# EAGLE design v1 (EAGLE 9.6.2)
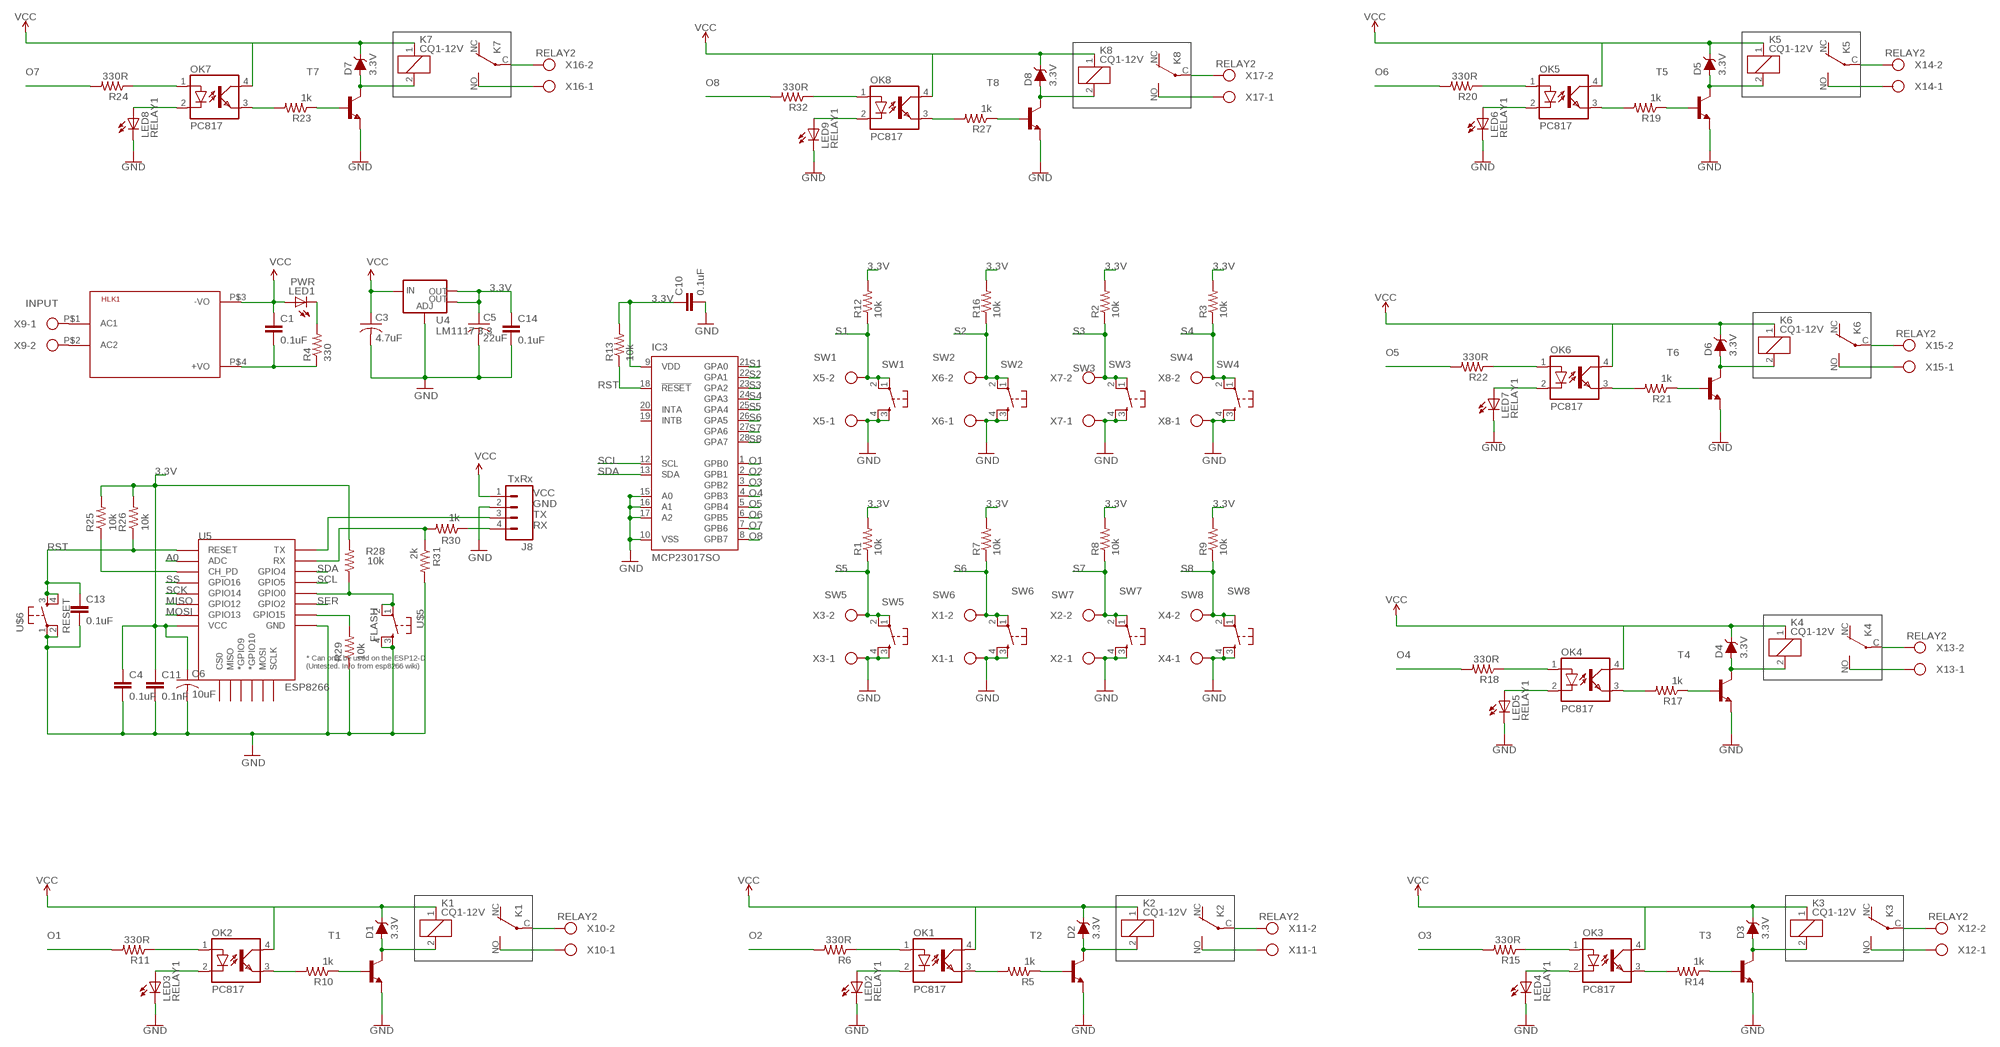
[diagram p0: schematic, sheet 1]

## Parts
C1  0.1uF  CAP0805  [0805]
C3  4.7uF  C-USC1206  [C1206]
C4  0.1uF  CAP0805  [0805]
C5  22uF  C-USC1206  [C1206]
C6  10uF  C-USC1206  [C1206]
C10  0.1uF  CAP0805  [0805]
C11  0.1nF  CAP0805  [0805]
C13  0.1uF  CAP0805  [0805]
C14  0.1uF  CAP0805  [0805]
D1  3.3V  DIODE-ZENER-MM3Z3V3T1G  [SOD-323]
D2  3.3V  DIODE-ZENER-MM3Z3V3T1G  [SOD-323]
D3  3.3V  DIODE-ZENER-MM3Z3V3T1G  [SOD-323]
D4  3.3V  DIODE-ZENER-MM3Z3V3T1G  [SOD-323]
D5  3.3V  DIODE-ZENER-MM3Z3V3T1G  [SOD-323]
D6  3.3V  DIODE-ZENER-MM3Z3V3T1G  [SOD-323]
D7  3.3V  DIODE-ZENER-MM3Z3V3T1G  [SOD-323]
D8  3.3V  DIODE-ZENER-MM3Z3V3T1G  [SOD-323]
HLK1  HLK-PM013W  [HLK-PM01]
IC3  MCP23017SO  [SO28W]
J8  TxRx  M04POLAR  [MOLEX-1X4]
K1  CQ1-12V  [CQ1]
K2  CQ1-12V  [CQ1]
K3  CQ1-12V  [CQ1]
K4  CQ1-12V  [CQ1]
K5  CQ1-12V  [CQ1]
K6  CQ1-12V  [CQ1]
K7  CQ1-12V  [CQ1]
K8  CQ1-12V  [CQ1]
LED1  PWR  LEDCHIP-LED0805  [CHIP-LED0805]
LED2  RELAY1  LEDCHIP-LED0805  [CHIP-LED0805]
LED3  RELAY1  LEDCHIP-LED0805  [CHIP-LED0805]
LED4  RELAY1  LEDCHIP-LED0805  [CHIP-LED0805]
LED5  RELAY1  LEDCHIP-LED0805  [CHIP-LED0805]
LED6  RELAY1  LEDCHIP-LED0805  [CHIP-LED0805]
LED7  RELAY1  LEDCHIP-LED0805  [CHIP-LED0805]
LED8  RELAY1  LEDCHIP-LED0805  [CHIP-LED0805]
LED9  RELAY1  LEDCHIP-LED0805  [CHIP-LED0805]
OK1  PC817  [DIL04]
OK2  PC817  [DIL04]
OK3  PC817  [DIL04]
OK4  PC817  [DIL04]
OK5  PC817  [DIL04]
OK6  PC817  [DIL04]
OK7  PC817  [DIL04]
OK8  PC817  [DIL04]
R1  10k  RESISTOR0805-RES  [0805]
R2  10k  RESISTOR0805-RES  [0805]
R3  10k  RESISTOR0805-RES  [0805]
R4  330  RESISTOR0805-RES  [0805]
R5  1k  RESISTOR0805-RES  [0805]
R6  330R  RESISTOR0805-RES  [0805]
R7  10k  RESISTOR0805-RES  [0805]
R8  10k  RESISTOR0805-RES  [0805]
R9  10k  RESISTOR0805-RES  [0805]
R10  1k  RESISTOR0805-RES  [0805]
R11  330R  RESISTOR0805-RES  [0805]
R12  10k  RESISTOR0805-RES  [0805]
R13  10k  RESISTOR0805-RES  [0805]
R14  1k  RESISTOR0805-RES  [0805]
R15  330R  RESISTOR0805-RES  [0805]
R16  10k  RESISTOR0805-RES  [0805]
R17  1k  RESISTOR0805-RES  [0805]
R18  330R  RESISTOR0805-RES  [0805]
R19  1k  RESISTOR0805-RES  [0805]
R20  330R  RESISTOR0805-RES  [0805]
R21  1k  RESISTOR0805-RES  [0805]
R22  330R  RESISTOR0805-RES  [0805]
R23  1k  RESISTOR0805-RES  [0805]
R24  330R  RESISTOR0805-RES  [0805]
R25  10k  RESISTOR0805-RES  [0805]
R26  10k  RESISTOR0805-RES  [0805]
R27  1k  RESISTOR0805-RES  [0805]
R28  10k  RESISTOR0805-RES  [0805]
R29  10k  RESISTOR0805-RES  [0805]
R30  1k  RESISTOR0805-RES  [0805]
R31  2k  RESISTOR0805-RES  [0805]
R32  330R  RESISTOR0805-RES  [0805]
T1  -NPN-SOT23-BEC  [SOT23-BEC]
T2  -NPN-SOT23-BEC  [SOT23-BEC]
T3  -NPN-SOT23-BEC  [SOT23-BEC]
T4  -NPN-SOT23-BEC  [SOT23-BEC]
T5  -NPN-SOT23-BEC  [SOT23-BEC]
T6  -NPN-SOT23-BEC  [SOT23-BEC]
T7  -NPN-SOT23-BEC  [SOT23-BEC]
T8  -NPN-SOT23-BEC  [SOT23-BEC]
U4  LM1117 3.3  V_REG_LM1117SOT223  [SOT223]
U5  ESP8266  ESP12ESMD  [ESP12E-SMD]
U$1  SW1  TACTILE-SWITCH-PTH  [TAC-SWITCH-PTH]
U$2  SW2  TACTILE-SWITCH-PTH  [TAC-SWITCH-PTH]
U$3  SW5  TACTILE-SWITCH-PTH  [TAC-SWITCH-PTH]
U$4  SW3  TACTILE-SWITCH-PTH  [TAC-SWITCH-PTH]
U$5  FLASH  TACTILE-SWITCH-PTH  [TAC-SWITCH-PTH]
U$6  RESET  TACTILE-SWITCH-PTH  [TAC-SWITCH-PTH]
U$7  SW4  TACTILE-SWITCH-PTH  [TAC-SWITCH-PTH]
U$8  SW6  TACTILE-SWITCH-PTH  [TAC-SWITCH-PTH]
U$9  SW7  TACTILE-SWITCH-PTH  [TAC-SWITCH-PTH]
U$10  SW8  TACTILE-SWITCH-PTH  [TAC-SWITCH-PTH]
X1  SW6  W237-102  [W237-102]
X2  SW7  W237-102  [W237-102]
X3  SW5  W237-102  [W237-102]
X4  SW8  W237-102  [W237-102]
X5  SW1  W237-102  [W237-102]
X6  SW2  W237-102  [W237-102]
X7  SW3  W237-102  [W237-102]
X8  SW4  W237-102  [W237-102]
X9  INPUT  W237-102  [W237-102]
X10  RELAY2  W237-102  [W237-102]
X11  RELAY2  W237-102  [W237-102]
X12  RELAY2  W237-102  [W237-102]
X13  RELAY2  W237-102  [W237-102]
X14  RELAY2  W237-102  [W237-102]
X15  RELAY2  W237-102  [W237-102]
X16  RELAY2  W237-102  [W237-102]
X17  RELAY2  W237-102  [W237-102]

## Nets
1: D2.A K2.2 T2.C
2: D3.A K3.2 T3.C
3: D4.A K4.2 T4.C
3.3V: C4.1 C5.1 C6.1 C10.1 C11.1 C14.1 IC3.9(VDD) R1.2 R2.2 R3.2 R7.2 R8.2 R9.2 R12.2 R13.2 R16.2 R25.2 R26.2 R28.2 U4.2(OUT) U4.4(OUT) U5.VCC
4: D5.A K5.2 T5.C
5: D6.A K6.2 T6.C
6: D7.A K7.2 T7.C
7: D8.A K8.2 T8.C
22: D1.A K1.2 T1.C
A0: U5.ADC
GND: C3.2 C4.2 C5.2 C6.2 C10.2 C11.2 C13.2 C14.2 IC3.10(VSS) IC3.15(A0) IC3.16(A1) IC3.17(A2) J8.2 LED2.C LED3.C LED4.C LED5.C LED6.C LED7.C LED8.C LED9.C R29.1 R31.2 T1.E T2.E T3.E T4.E T5.E T6.E T7.E T8.E U4.1(ADJ) U5.GND U$1.3 U$1.4 U$2.3 U$2.4 U$3.3 U$3.4 U$4.3 U$4.4 U$5.3 U$5.4 U$6.1 U$6.2 U$7.3 U$7.4 U$8.3 U$8.4 U$9.3 U$9.4 U$10.3 U$10.4 X1.1 X2.1 X3.1 X4.1 X5.1 X6.1 X7.1 X8.1
INSS: OK2.1(A) R11.1
INSS1: OK1.1(A) R6.1
INSS2: OK3.1(A) R15.1
INSS3: OK4.1(A) R18.1
INSS4: OK5.1(A) R20.1
INSS5: OK6.1(A) R22.1
INSS6: OK7.1(A) R24.1
INSS7: OK8.1(A) R32.1
LEDS: LED3.A OK2.2(C)
LEDS1: LED2.A OK1.2(C)
LEDS2: LED4.A OK3.2(C)
LEDS3: LED5.A OK4.2(C)
LEDS4: LED6.A OK5.2(C)
LEDS5: LED7.A OK6.2(C)
LEDS6: LED8.A OK7.2(C)
LEDS7: LED9.A OK8.2(C)
MISO: U5.GPIO12
MOSI: U5.GPIO13
N$1: C1.2 HLK1.P$4(+VO) R4.1
N$2: HLK1.P$1(AC1) X9.1
N$3: HLK1.P$2(AC2) X9.2
N$4: K1.NO(2:S) X10.1
N$5: K1.C(2:P) X10.2
N$6: R5.1 T2.B
N$7: OK1.3(EMIT) R5.2
N$8: K2.NO(2:S) X11.1
N$9: LED1.C R4.2
N$10: K2.C(2:P) X11.2
N$11: R14.1 T3.B
N$12: OK3.3(EMIT) R14.2
N$13: K3.NO(2:S) X12.1
N$14: K3.C(2:P) X12.2
N$15: R17.1 T4.B
N$16: OK4.3(EMIT) R17.2
N$17: K4.NO(2:S) X13.1
N$18: K4.C(2:P) X13.2
N$19: R19.1 T5.B
N$20: R10.1 T1.B
N$21: OK5.3(EMIT) R19.2
N$22: OK2.3(EMIT) R10.2
N$23: K5.NO(2:S) X14.1
N$24: K5.C(2:P) X14.2
N$25: R21.1 T6.B
N$26: R30.2 R31.1 U5.RXD0(RX)
N$27: OK6.3(EMIT) R21.2
N$28: K6.NO(2:S) X15.1
N$29: K6.C(2:P) X15.2
N$30: R23.1 T7.B
N$31: OK7.3(EMIT) R23.2
N$32: K7.NO(2:S) X16.1
N$33: K7.C(2:P) X16.2
N$34: R27.1 T8.B
N$35: OK8.3(EMIT) R27.2
N$36: R25.1 U5.CH_PD
N$37: R28.1 U5.GPIO0 U$5.1 U$5.2
N$38: R29.2 U5.GPIO15
N$39: K8.NO(2:S) X17.1
N$40: K8.C(2:P) X17.2
O1: IC3.1(GPB0) R11.2
O2: IC3.2(GPB1) R6.2
O3: IC3.3(GPB2) R15.2
O4: IC3.4(GPB3) R18.2
O5: IC3.5(GPB4) R22.2
O6: IC3.6(GPB5) R20.2
O7: IC3.7(GPB6) R24.2
O8: IC3.8(GPB7) R32.2
RST: C13.1 IC3.18(!RESET) R13.1 R26.1 U5.RESET U$6.3 U$6.4
RX: J8.4 R30.1
S1: IC3.21(GPA0) R12.1 U$1.1 U$1.2 X5.2
S2: IC3.22(GPA1) R16.1 U$2.1 U$2.2 X6.2
S3: IC3.23(GPA2) R2.1 U$4.1 U$4.2 X7.2
S4: IC3.24(GPA3) R3.1 U$7.1 U$7.2 X8.2
S5: IC3.25(GPA4) R1.1 U$3.1 U$3.2 X3.2
S6: IC3.26(GPA5) R7.1 U$8.1 U$8.2 X1.2
S7: IC3.27(GPA6) R8.1 U$9.1 U$9.2 X2.2
S8: IC3.28(GPA7) R9.1 U$10.1 U$10.2 X4.2
SCK: U5.GPIO14
SCL: IC3.12(SCL) U5.GPIO5
SDA: IC3.13(SDA) U5.GPIO4
SER: U5.GPIO2
SS: U5.GPIO16
TX: J8.3 U5.TXD0(TX)
VCC: C1.1 C3.1 D1.C D2.C D3.C D4.C D5.C D6.C D7.C D8.C HLK1.P$3(-VO) J8.1 K1.1 K2.1 K3.1 K4.1 K5.1 K6.1 K7.1 K8.1 LED1.A OK1.4(COL) OK2.4(COL) OK3.4(COL) OK4.4(COL) OK5.4(COL) OK6.4(COL) OK7.4(COL) OK8.4(COL) U4.3(IN)
Unconnected: IC3.19(INTB) IC3.20(INTA) K1.NC(2:O) K2.NC(2:O) K3.NC(2:O) K4.NC(2:O) K5.NC(2:O) K6.NC(2:O) K7.NC(2:O) K8.NC(2:O) U5.CS0 U5.GPIO9(*GPIO9) U5.GPIO10(*GPIO10) U5.MISO U5.MOSI U5.SCLK

## Library data of the parts
C1 C4 C10 C11 C13 C14 = SparkFun-Passives:CAP: Capacitor Standard 0603 ceramic capacitor, and 0.1" leaded capacitor.
C3 C5 C6 = adafruit:C-US: CAPACITOR, American symbol
D1-D8 = SparkFun-DiscreteSemi:DIODE-ZENER: Zener Diode A Zener diode allows current to flow from its anode to its cathode like a normal semiconductor diode, but it also permits current to flow in the reverse direction when its "Zener voltage" is reached. - WIkipedia; PROD_ID: DIO-11284
HLK1 = HLK-PM01:HLK-PM01: Hi-Link Power Supply HLK-PM01 3W Author: Ahmed Said <https://github.com/AhmedSaid/EAGLELibraries>
IC3 = microchip:MCP23017: http://ww1.microchip.com/downloads/en/DeviceDoc/21952a.pdf Source: http://ww1.microchip.com/downloads/en/DeviceDoc/21952a.pdf; MF: MICROCHIP; MPN: MCP23017-E/SO; OC_FARNELL: 1332087; OC_NEWARK: 31K2958
J8 = SparkFun-Connectors:M04: Header 4 Standard 4-pin 0.1" header. Use with straight break away headers (SKU : PRT-00116), right angle break away headers (PRT-00553), swiss pins (PRT-00743), machine pins (PRT-00117), and female headers (PRT-00115). Molex polarized connector foot print use with SKU : PRT-08231 with associated crimp pins and housings. 1MM SMD Version SKU: PRT-10208
K1-K8 = relay5vdc:CQ1-12V: AUTOMOTIVE QUIET RELAY NAiS Source: http://www.mew-europe.com/.. en_ds_61208_0000.pdf; OC_FARNELL: unknown; OC_NEWARK: unknown
LED1-LED9 = adafruit:LED: LED OSRAM: - CHIPLED LG R971, LG N971, LY N971, LG Q971, LY Q971, LO R971, LY R971 LH N974, LH R974 LS Q976, LO Q976, LY Q976 LO Q996 - Hyper CHIPLED LW Q18S LB Q993, LB Q99A, LB R99A - SideLED LS A670, LO A670, LY A670, LG A670, LP A670 LB A673, LV A673, LT A673, LW A673 LH A674 LY A675 LS A676, LA A676, LO A676, LY A676, LW A676 LS A679, LY A679, LG A679 - Hyper Micro SIDELED® LS Y876, LA Y876, LO Y876, LY Y876 LT Y87S - SmartLED LW L88C, LW L88S LB L89C, LB L89S, LG L890 LS L89K, LO L89K, LY L89K LS L896, LA L896, LO L896, LY L896 - TOPLED LS T670, LO T670, LY T670, LG T670, LP T670 LSG T670, LSP T670, LSY T670, LOP T670, LYG T670 LG T671, LOG T671, LSG T671 LB T673, LV T673, LT T673, LW T673 LH T674 LS T676, LA T676, LO T676, LY T676, LB T676, LH T676, LSB T676, LW T676 LB T67C, LV T67C, LT T67C, LS T67K, LO T67K, LY T67K, LW E67C LS E67B, LA E67B, LO E67B, LY E67B, LB E67C, LV E67C, LT E67C LW T67C LS T679, LY T679, LG T679 LS T770, LO T770, LY T770, LG T770, LP T770 LB T773, LV T773, LT T773, LW T773 LH T774 LS E675, LA E675, LY E675, LS T675 LS T776, LA T776, LO T776, LY T776, LB T776 LHGB T686 LT T68C, LB T68C - Hyper Mini TOPLED® LB M676 - Mini TOPLED Santana® LG M470 LS M47K, LO M47K, LY M47K Source: http://www.osram.convergy.de/
OK1-OK8 = optocoupler:PC817: SHARP OPTO COUPLER; MPN: PC817X4J000F; OC_FARNELL: 9707727; OC_NEWARK: 97K7059
R1-R32 = SparkFun-Resistors:RESISTOR: Resistor Basic schematic elements and footprints for 0603, 1206, and PTH resistors.
T1-T8 = DC_LOAD_AU:*-NPN-: NPN Transistror BF959 corrected 2008.03.06
U4 = SparkFun-PowerIC:V_REG_LM1117: Voltage Regulator LM1117 Standard adjustable voltage regulator but in SMD form. Spark Fun Electronics SKU : COM-00595; PROD_ID: VREG-08170
U5 = esp8266modules:ESP12E: ESP12E Module
U$1-U$10 = GeekAmmo:TACTILE-SWITCH: Tactile Switch 4 Pins, SPST NO
X1-X17 = con-wago-500:W237-102: WAGO SCREW CLAMP; MPN: 237-102; OC_FARNELL: unknown; OC_NEWARK: 70K9898

## Board
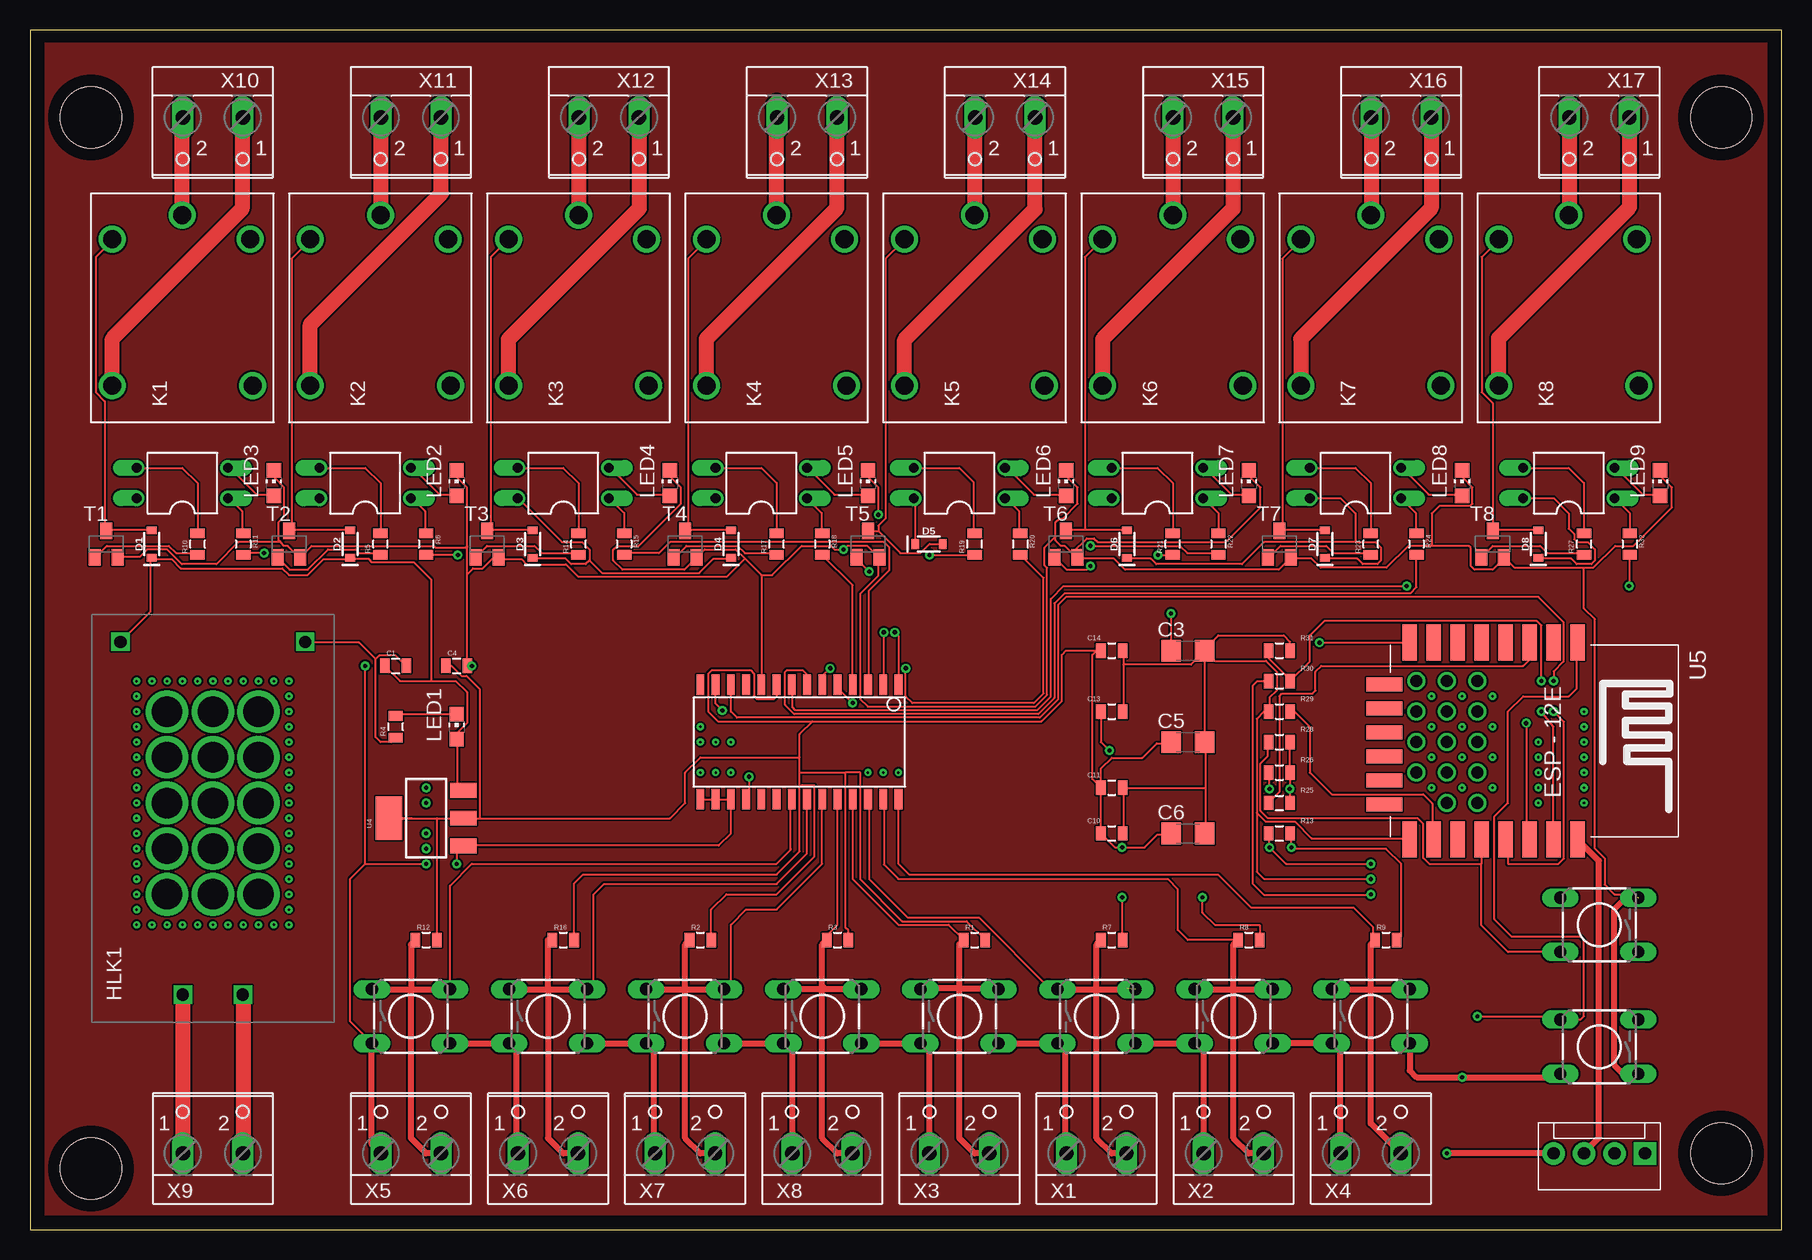
[diagram p1: board, top side]
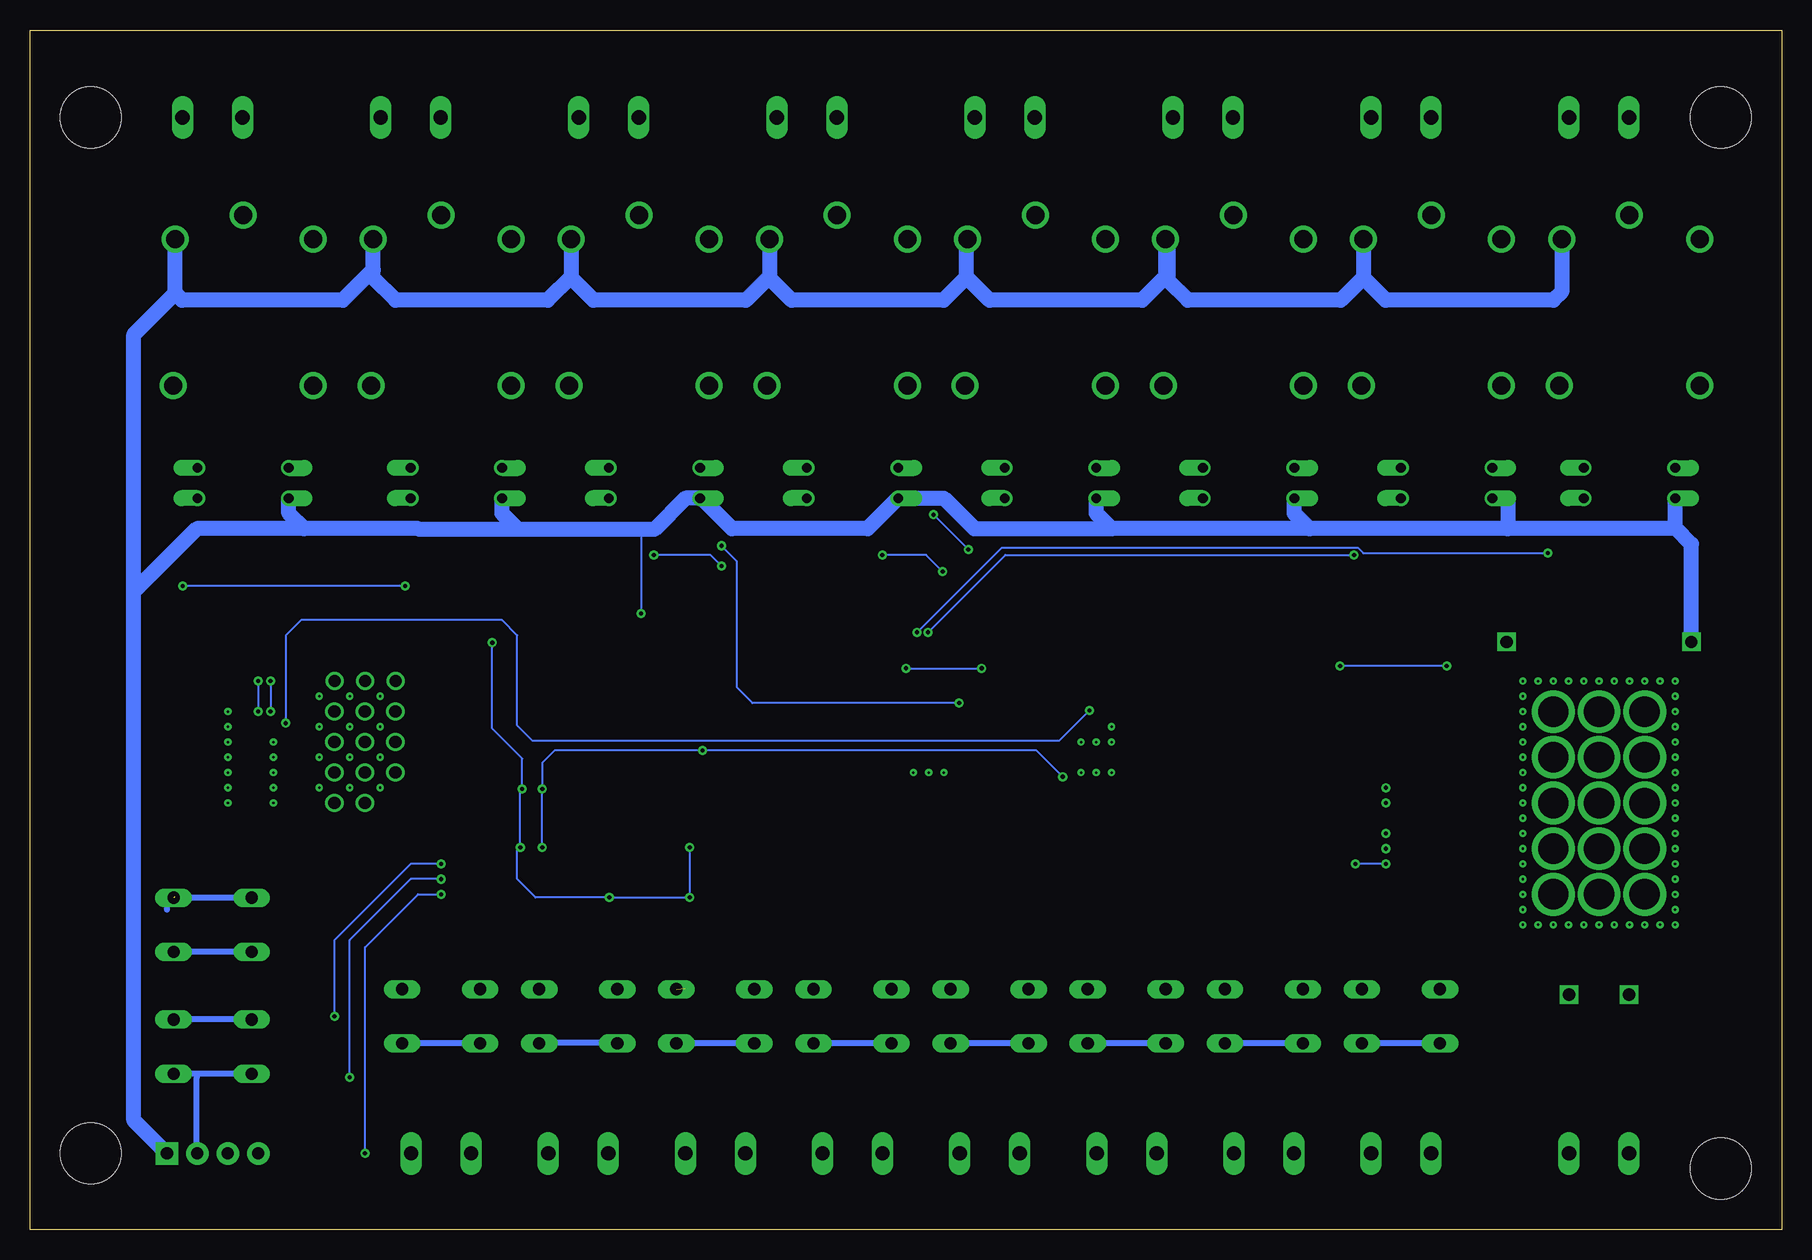
[diagram p2: board, bottom side, seen from below]

Size 146.03 x 100 mm. Coordinates in mm from the lower left corner, seen from the top.
Outline: 0,0 146.03,0 146.03,100 0,100 0,0
Copper layers (1*16): Top 0.035mm / dielectric 1.5mm / Bottom 0.035mm
Design rules "default": minimum track width 6mil, minimum drill 0.35mm, track to track 6mil, track to pad 6mil, pad to pad 6mil, via to via 6mil, smd to smd 6mil, copper to edge 40mil, drill to drill 6mil, minimum pad ring 10mil, minimum via ring 8mil, stop-mask expansion 4mil, vias tented up to drill 0mil, thermal gap 10mil
Holes 5.08 mm at 5.08,92.71 140.97,92.71 140.97,6.35 5.08,5.08

### Footprints (pad centres in the part's own frame; a part is rotated, then mirrored left to right if it is on the bottom)
0805 = smd 0.8 x 1.2: 1 -0.9,0; 2 0.9,0
C1206 = smd 1.6 x 1.8: 1 -1.4,0; 2 1.4,0
SOD-323 = smd 0.63 x 0.83: A 1.15,0; C -1.15,0
HLK-PM01 = drill 1.016 square: P$1 -14.7,2.5; P$2 -14.7,-2.5; P$3 14.7,7.7; P$4 14.7,-7.7
SO28W = smd 0.65 x 1.7: 1 -7.62,-4.78; 2 -6.35,-4.78; 3 -5.08,-4.78; 4 -3.81,-4.78; 5 -2.54,-4.78; 6 -1.27,-4.78; 7 0,-4.78; 8 1.27,-4.78; 9 2.54,-4.78; 10 3.81,-4.78; 11 5.08,-4.78; 12 6.35,-4.78; 13 7.62,-4.78; 14 8.89,-4.78; 15 8.89,4.78; 16 7.62,4.78; 17 6.35,4.78; 18 5.08,4.78; 19 3.81,4.78; 20 2.54,4.78; 21 1.27,4.78; 22 0,4.78; 23 -1.27,4.78; 24 -2.54,4.78; 25 -3.81,4.78; 26 -5.08,4.78; 27 -6.35,4.78; 28 -7.62,4.78
MOLEX-1X4 = drill 1.016 pad 1.88 square: 1 0,0 | drill 1.016 pad 1.88: 2 2.54,0; 3 5.08,0; 4 7.62,0
CQ1 = drill 1.5: 1 5.08,-5.66; 2 5.08,5.842; C 7.112,0; NC -7.112,-5.842; NO -7.112,5.842
CHIP-LED0805 = smd 1.2 x 1.2: A 0,-1.05; C 0,1.05
DIL04 = drill 0.813 offset: 1 -1.27,-3.81; 2 1.27,-3.81; 3 1.27,3.81; 4 -1.27,3.81
SOT23-BEC = smd 1 x 1.4: B -0.95,-1.1; C 0,1.1; E 0.95,-1.1
SOT223 = smd 1.219 x 2.235: 1 -2.311,-3.099; 2 0,-3.099; 3 2.311,-3.099 | smd 3.6 x 2.2: 4 0,3.099
ESP12E-SMD = smd 3 x 1.2: ADC -8.3,3.8; CH_PD -8.3,1.8; GND 8.1,-8.2; GPIO0 8.1,-2.2; GPIO2 8.1,-4.2; GPIO4 8.1,1.8; GPIO5 8.1,-0.2; GPIO12 -8.3,-4.2; GPIO13 -8.3,-6.2; GPIO14 -8.3,-2.2; GPIO15 8.1,-6.2; GPIO16 -8.3,-0.2; RESET -8.3,5.8; RXD0 8.1,3.8; TXD0 8.1,5.8; VCC -8.3,-8.2 | smd 1.2 x 3: CS0 -4.8,-10.3; GPIO9 -0.8,-10.3; GPIO10 1.2,-10.3; MISO -2.8,-10.3; MOSI 3.2,-10.3; SCLK 5.2,-10.3
TAC-SWITCH-PTH = drill 1.016 pad 1.524 long: 1 -3.251,2.261; 2 3.251,2.261; 3 -3.251,-2.261; 4 3.251,-2.261
W237-102 = drill 1.194 long: 1 -2.5,-1.27; 2 2.5,-1.27

### Placement (x,y rotation side)
C1  30.48,46.99 0 top
C3  96.52,48.26 0 top
C4  35.56,46.99 0 top
C5  96.52,40.64 0 top
C6  96.52,33.02 0 top
C10  90.17,33.02 0 top
C11  90.17,36.83 0 top
C13  90.17,43.18 0 top
C14  90.17,48.26 0 top
D1  10.16,57.15 90 top
D2  26.67,57.15 90 top
D3  41.91,57.15 90 top
D4  58.42,57.15 90 top
D5  74.93,57.15 0 top
D6  91.44,57.15 90 top
D7  107.95,57.15 90 top
D8  125.73,57.15 90 top
HLK1  15.24,34.29 90 top
IC3  64.77,40.64 180 top
J8  134.62,6.35 180 top
K1  12.7,77.47 90 top
K2  29.21,77.47 90 top
K3  45.72,77.47 90 top
K4  62.23,77.47 90 top
K5  78.74,77.47 90 top
K6  95.25,77.47 90 top
K7  111.76,77.47 90 top
K8  128.27,77.47 90 top
LED1  35.56,41.91 0 top
LED2  35.56,62.23 0 top
LED3  20.32,62.23 0 top
LED4  53.34,62.23 0 top
LED5  69.85,62.23 0 top
LED6  86.36,62.23 0 top
LED7  101.6,62.23 0 top
LED8  119.38,62.23 0 top
LED9  135.89,62.23 0 top
OK1  27.94,62.23 90 top
OK2  12.7,62.23 90 top
OK3  44.45,62.23 90 top
OK4  60.96,62.23 90 top
OK5  77.47,62.23 90 top
OK6  93.98,62.23 90 top
OK7  110.49,62.23 90 top
OK8  128.27,62.23 90 top
R1  78.74,24.13 0 top
R2  55.88,24.13 0 top
R3  67.31,24.13 0 top
R4  30.48,41.91 90 top
R5  29.21,57.15 90 top
R6  33.02,57.15 270 top
R7  90.17,24.13 0 top
R8  101.6,24.13 0 top
R9  113.03,24.13 0 top
R10  13.97,57.15 90 top
R11  17.78,57.15 270 top
R12  33.02,24.13 0 top
R13  104.14,33.02 0 top
R14  45.72,57.15 90 top
R15  49.53,57.15 270 top
R16  44.45,24.13 0 top
R17  62.23,57.15 90 top
R18  66.04,57.15 270 top
R19  78.74,57.15 90 top
R20  82.55,57.15 270 top
R21  95.25,57.15 90 top
R22  99.06,57.15 270 top
R23  111.76,57.15 90 top
R24  115.57,57.15 270 top
R25  104.14,35.56 0 top
R26  104.14,38.1 0 top
R27  129.54,57.15 90 top
R28  104.14,40.64 0 top
R29  104.14,43.18 0 top
R30  104.14,45.72 0 top
R31  104.14,48.26 0 top
R32  133.35,57.15 270 top
T1  6.35,57.15 0 top
T2  21.59,57.15 0 top
T3  38.1,57.15 0 top
T4  54.61,57.15 0 top
T5  69.85,57.15 0 top
T6  86.36,57.15 0 top
T7  104.14,57.15 0 top
T8  121.92,57.15 0 top
U4  33.02,34.29 90 top
U5  123.19,40.64 270 top
U$1  31.75,17.78 0 top
U$2  43.18,17.78 0 top
U$3  77.47,17.78 0 top
U$4  54.61,17.78 0 top
U$5  130.81,25.4 180 top
U$6  130.81,15.24 180 top
U$7  66.04,17.78 0 top
U$8  88.9,17.78 0 top
U$9  100.33,17.78 0 top
U$10  111.76,17.78 0 top
X1  88.9,7.62 0 top
X2  100.33,7.62 0 top
X3  77.47,7.62 0 top
X4  111.76,7.62 0 top
X5  31.75,7.62 0 top
X6  43.18,7.62 0 top
X7  54.61,7.62 0 top
X8  66.04,7.62 0 top
X9  15.24,7.62 0 top
X10  15.24,91.44 180 top
X11  31.75,91.44 180 top
X12  48.26,91.44 180 top
X13  64.77,91.44 180 top
X14  81.28,91.44 180 top
X15  97.79,91.44 180 top
X16  114.3,91.44 180 top
X17  130.81,91.44 180 top

### Tracks (layer width: path | path; a pad name or v marks a point on that pad's centre or on a via)
1
  Top 0.152: 21.79,58.37 21.64,58.37 T2.C 21.79,58.37 | 21.79,58.37 26.67,58.37 D2.A | 21.79,58.37 21.79,80.92 23.32,82.45 K2.2
2
  Top 0.152: 38.41,58.37 38.1,58.37 T3.C 38.41,58.37 | 38.41,58.37 41.91,58.37 D3.A | 38.41,58.37 38.41,81.08 K3.2
3
  Top 0.152: 54.86,58.37 54.71,58.37 T4.C 54.86,58.37 | 54.86,58.37 58.37,58.37 D4.A | 54.86,58.37 54.86,80.92 56.39,82.45 K4.2
3.3V  (via drill 0.35)
  Top 0.152: R13.2 105.16,32.92 v105.16,31.85 105.33,31.67 105.41,31.75 113.03,31.75 114.3,30.48 114.3,24.5 R9.2 | 105,38.1 v105,36.73 105,35.66 R25.2 | 105,38.1 105,40.54 R28.2 | 105,38.1 R26.2 | 89.31,33.07 C10.1 | v91.03,27.69 91.03,24.23 R7.2 | 89.31,32.92 C10.1 | C6.1 95.1,32.92 93.98,32.92 92.91,31.85 v91.03,31.85 90.44,31.85 C10.1 | C5.1 95.1,40.54 93.93,40.54 92.71,39.32 90.17,39.32 89.27,38.42 C11.1 | 33.98,24.23 R12.2 33.92,34.29 | 37.49,34.29 37.49,45.06 36.39,46.16 35.97,46.16 35.14,46.99 C4.1 | 31.85,34.29 U4.4 33.92,34.29 | 64.16,36.88 64.31,37.03 65.38,37.03 65.38,31.09 62.23,27.94 58.05,27.94 56.78,26.67 R2.2 | R3.2 68.21,24.94 67.97,25.15 67.97,38.1 | 33.92,34.29 U4.2 37.49,34.29 | C11.1 88.54,37.56 88.54,47.9 88.9,48.26 | C10.1 C11.1 | R16.2 45.35,28.84 46.1,29.59 62.23,29.59 64.16,31.52 64.16,36.88 | R8.2 102.5,25.36 98.79,25.36 97.74,26.42 v97.74,27.69 | v107.49,48.92 114.97,48.92 U5.VCC | 64.16,36.88 64.16,38.1 | 37.49,34.29 53.34,34.29 54.61,35.56 54.61,38.1 55.88,39.37 64.16,39.37 | IC3.9 62.23,44.45 61.98,44.2 60.66,44.2 60.35,44.5 60.35,46.33 60.05,46.63 56.84,46.63 56.54,46.33 56.54,43.18 57.35,42.37 65.23,42.37 | 65.23,42.37 84.3,42.37 86,44.07 86,47.9 86.36,48.26 88.9,48.26 | 88.9,48.26 C14.1 | 67.97,38.1 69.19,38.1 69.19,29.21 72.69,25.7 78.06,25.7 R1.2 | 64.16,38.1 67.97,38.1 | 64.16,38.1 64.16,39.37 | 64.16,39.37 64.16,41.3 65.23,42.37
  Bottom 0.152: v91.03,31.85 v91.03,27.69 v97.74,27.69 103.89,27.69 105.41,29.21 105.41,31.6 v105.16,31.85 105.16,36.68 105,36.83 | v107.49,48.92 107.49,41.76 105,39.27 105,36.83 | v105,36.73 105,36.83
4
  Top 0.152: D5.A 74.98,57.15 74.22,56.39 72.54,56.39 70.71,58.22 | 70.71,58.22 69.95,58.22 T5.C | 70.71,58.22 70.71,58.67 71.32,59.28 71.32,80.92 72.85,82.45 K5.2
5
  Top 0.152: 87.94,58.37 86.41,58.37 T6.C | 87.94,58.37 91.44,58.37 D6.A | 87.94,58.37 87.94,81.08 K6.2
6
  Top 0.152: 104.39,58.37 104.24,58.37 T7.C 104.39,58.37 | 104.39,58.37 107.9,58.37 D7.A | 104.39,58.37 104.39,80.92 105.92,82.45 K7.2
7
  Top 0.152: 121.92,58.37 125.73,58.37 D8.A | 121.92,58.37 121.92,68.89 121.01,69.8 121.01,81.08 122.38,82.45 K8.2 | 121.92,58.37 T8.C
22
  Top 0.152: D1.A 10.06,58.37 6.4,58.37 T1.C 6.25,58.37 6.25,69.04 5.49,69.8 5.49,81.08 6.86,82.45 K1.2
GND  (via drill 0.35)  (1 unrouted)
  Top 0.152: v70.71,59.59 70.71,61.87 69.95,62.64 69.95,63.25 LED5.C | LED4.C 53.34,62.79 54.25,61.87 54.25,60.5 50.75,57 48.92,57 48.62,56.69 48.62,55.78 49.38,55.02 54.56,55.02 55.47,55.93 T4.E 55.63,56.08 56.24,56.69 58.83,56.69 59.59,55.93 | 60.96,54.56 IC3.10 | 59.59,55.93 60.96,54.56 | 60.96,54.56 61.87,54.56 64.31,57 66.75,57 67.06,56.69 v67.82,56.69 68.12,57 69.8,57 70.71,56.08 T5.E 70.71,55.93 70.71,54.51 69.19,52.98 69.19,44.25 69.85,43.59 83.8,43.59 84.78,44.58 84.78,55.15 84.58,55.35 84.58,56.84 85.5,57.76 | 36.58,47.09 C4.2 36.42,47.03 36.42,54.61 | 36.42,57 36.42,61.87 35.66,62.64 35.66,63.25 LED2.C | 36.42,57 36.27,56.84 33.83,56.84 33.68,57 23.47,57 22.55,56.08 T2.E 22.4,56.08 21.49,57 21.18,57 20.88,57.3 | 20.88,57.3 20.73,57.45 20.73,58.98 21.18,59.44 21.18,61.87 20.42,62.64 20.42,63.25 LED3.C | 20.88,57.3 17.37,57.3 15.54,55.47 12.65,55.47 11.43,56.69 9.75,56.69 9.14,56.08 7.32,56.08 T1.E | 59.59,55.93 58.06,54.41 45.72,54.41 44.67,55.46 41.4,55.46 40.98,55.88 39.22,55.88 T3.E 39.17,55.93 38.55,55.93 37.74,55.12 36.93,55.12 36.42,54.61 | 85.5,57.76 85.5,57.45 85.95,57 86.26,57 86.87,56.39 | 85.5,57.76 85.5,58.98 85.8,59.28 86.11,59.28 87.33,60.5 87.33,61.87 86.41,62.79 86.41,63.25 LED6.C | 86.87,56.39 87.17,56.08 T6.E | 86.87,56.39 88.09,57.61 88.7,57.61 89,57.3 99.67,57.3 102.56,60.2 102.56,61.87 101.65,62.79 101.65,63.25 LED7.C | 86.87,56.39 T6.E | LED8.C 119.48,63.25 119.48,62.64 120.24,61.87 120.24,60.52 120.08,60.35 117.5,60.35 116.84,59.69 116.84,57 | 129.54,55.17 123.75,55.17 122.99,55.93 T8.E 122.83,55.93 121.92,55.02 120.4,55.02 120.09,55.32 120.09,56.84 119.94,57 116.84,57
  Top 0.152: 129.54,55.17 130.3,55.17 132.13,57 133.66,57 136.85,60.2 136.85,61.87 135.94,62.79 135.94,63.25 LED9.C | 116.84,57 114.91,57 113.08,55.17 107.59,55.17 106.83,55.93 105.16,55.93 T7.E 105,55.93 104.09,55.02 91.29,55.02 90.37,55.93 87.33,55.93 T6.E | C10.2 91.14,33.07 91.14,36.83 C11.2 97.99,36.83 | 97.99,36.83 97.99,40.54 C5.2 | 97.99,36.83 97.99,33.07 C6.2 | 91.14,47.09 91.14,48.16 C14.2 | 91.14,47.09 91.14,43.28 C13.2 | 97.99,48.16 98.75,47.4 103.02,47.4 103.94,46.48 103.94,44.96 103.33,44.35 103.33,43.28 R29.1 103.17,43.13 103.12,43.18 102.87,43.18 102.26,42.57 102.26,34.75 | 97.99,48.16 C3.2 | 105,48.31 R31.2 105.04,49 104.51,49.53 99.06,49.53 97.92,48.39 C3.2 | 91.14,47.09 96.77,47.09 97.84,48.16 C3.2 | U5.GND 114.91,32.61 106.83,32.61 105.46,33.98 103.02,33.98 102.26,34.75 | 97.84,40.69 C5.2 | 55.93,35.97 IC3.15 IC3.16 | 58.37,35.97 IC3.17 | 57.15,35.97 IC3.16 | U$8.4 92.2,15.54 97.08,15.54 U$9.3 97.08,15.39 97.69,14.78 97.69,6.4 97.8,6.36 X2.1 | U$3.4 80.77,15.54 85.65,15.54 U$8.3 85.65,15.39 86.26,14.78 86.26,6.4 X1.1 | U$7.4 69.34,15.54 74.22,15.54 U$3.3 74.22,15.39 74.83,14.78 74.83,6.4 74.94,6.36 X3.1 | 63.51,6.36 X8.1 | U$2.4 46.48,15.54 51.36,15.54 U$4.3 51.36,15.39 51.79,14.96 51.97,14.78 51.97,6.4 X7.1 | U$1.4 35.05,15.54 39.93,15.54 U$2.3 39.93,15.39 40.54,14.78 40.54,6.4 X6.1 | U$1.3 28.5,15.54 26.67,17.37 26.67,29.21 27.94,30.48 | 115.06,15.39 U$10.4 114.91,15.54 | 133.96,27.74 133.96,27.94 | 27.94,30.48 v33.02,30.48 | v35.56,30.48 35.56,31.42 U4.1 36.12,32 57.4,32 58.42,33.02 IC3.17 | v111.76,29.21 102.87,29.21 102.26,29.82 102.26,34.75 | 97.92,48.09 97.99,48.16
  Top 0.152: C5.2 C3.2 | IC3.16 IC3.17 | U$5.3 134.06,27.94 132.08,27.94 131.27,28.75 131.27,30.95 130.45,31.76 130.45,50.88 129.54,51.79 129.54,55.17 | 36.42,57 36.42,56.85 36.42,56.84 36.42,54.61 | 27.94,30.48 v27.94,46.99
  Top 0.508: U$1.4 39.8,15.52 39.93,15.39 | U$2.3 40.54,14.91 40.54,6.4 | U$2.4 51.23,15.52 51.79,14.96 | U$4.3 51.97,14.91 51.97,6.4 | U$4.4 U$7.3 63.51,14.8 63.51,6.36 | U$7.4 74.09,15.52 74.22,15.39 | U$3.3 74.94,14.8 74.94,6.36 | U$3.4 85.52,15.52 85.65,15.39 | U$8.3 86.26,14.91 86.26,6.4 | U$8.4 96.95,15.52 97.08,15.39 | U$9.3 97.8,14.8 97.8,6.36 | X4.1 109.22,6.39 109.22,15.24 108.94,15.52 U$10.3 U$9.4 | X5.1 28.5,7.1 U$1.3 | U$6.2 127.28,12.7 v119.38,12.7 115.57,12.7 115.01,13.26 U$10.4 | U$6.1 132.79,12.98 132.08,13.69 132.08,26.67 133.35,27.94 133.96,27.94
  Bottom 0.152: v67.82,56.69 v70.71,59.59 | 132.13,12.95 133.96,12.95 U$6.1 | 132.13,12.95 127.56,12.95 U$6.2 | 132.13,12.7 132.13,12.95 | 109.27,15.54 108.51,15.54 U$10.3 | 34.29,15.54 34.9,15.54 U$1.4 | 29.26,15.54 28.5,15.54 U$1.3 | U$2.4 46.33,15.54 39.93,15.54 U$2.3 | U$4.4 57.76,15.54 51.36,15.54 U$4.3 | U$7.4 69.19,15.54 62.79,15.54 U$7.3 | 103.48,15.54 U$9.4 | v33.02,30.48 v35.56,30.48 | v119.38,12.7 119.38,24.13 114.3,29.21 v111.76,29.21 | v27.94,46.99 v36.83,46.99
  Bottom 0.508: U$1.3 35.28,15.52 35.56,15.24 34.59,15.24 34.29,15.54 | U$2.3 46.71,15.52 46.99,15.24 | U$4.3 58.14,15.52 58.42,15.24 | U$7.3 69.57,15.52 69.85,15.24 | U$3.3 U$3.4 | U$8.3 U$8.4 | U$9.3 97.1,15.54 103.48,15.54 | U$10.3 U$10.4 | U$6.2 U$6.1 | J8.2 132.13,6.4 132.13,12.7 | U$5.4 U$5.3 134.62,27.1 134.62,26.67
INSS
  Top 0.152: R11.1 17.68,58.06 17.68,59.89 16.61,60.96 OK2.1
INSS1
  Top 0.152: R6.1 32.92,58.06 32.92,59.89 31.85,60.96 OK1.1
INSS2
  Top 0.152: R15.1 49.53,59.74 48.31,60.96 OK3.1
INSS3
  Top 0.152: OK4.1 65.99,59.74 65.99,58.06 R18.1
INSS4
  Top 0.152: R20.1 82.45,58.06 82.45,59.89 81.38,60.96 OK5.1
INSS5
  Top 0.152: R22.1 99.06,59.74 97.84,60.96 OK6.1
INSS6
  Top 0.152: OK7.1 115.52,59.74 115.52,58.06 R24.1
INSS7
  Top 0.152: R32.1 133.35,59.74 132.13,60.96 OK8.1
LEDS
  Top 0.152: LED3.A 20.27,61.27 18.9,61.27 16.61,63.55 OK2.2
LEDS1
  Top 0.152: LED2.A 35.51,61.27 34.14,61.27 31.85,63.55 OK1.2
LEDS2
  Top 0.152: LED4.A 53.34,61.27 50.6,61.27 48.31,63.55 OK3.2
LEDS3
  Top 0.152: LED5.A 69.8,61.27 67.06,61.27 64.77,63.55 OK4.2
LEDS4
  Top 0.152: LED6.A 86.26,61.27 83.67,61.27 81.38,63.55 OK5.2
LEDS5
  Top 0.152: LED7.A 101.5,61.27 100.13,61.27 97.84,63.55 OK6.2
LEDS6
  Top 0.152: LED8.A 119.33,61.27 116.59,61.27 114.3,63.55 OK7.2
LEDS7
  Top 0.152: LED9.A 135.79,61.27 134.42,61.27 132.13,63.55 OK8.2
N$1
  Top 0.152: 28.8,47.55 29.11,47.85 30.48,47.85 31.24,47.09 C1.2 | 28.8,47.55 27.43,48.92 23.01,48.92 HLK1.P$4 | R4.1 30.11,40.64 29.21,40.64 28.8,41.05 28.8,47.55
N$2
  Top 1.27: HLK1.P$1 X9.1
N$3
  Top 0.152: 17.83,19.05 17.83,19.51 HLK1.P$2
  Top 1.27: X9.2 17.83,6.44 17.83,19.05
N$4
  Top 1.27: K1.NO 6.86,74.27 17.68,85.09 17.68,92.65 X10.1
N$5
  Top 0.152: 12.8,92.66 X10.2
  Top 1.27: K1.C 12.7,92.71 X10.2 12.8,92.66
N$6
  Top 0.152: R5.1 29.11,56.39 27.43,56.39 27.13,56.69 24.84,56.69 23.16,55.02 21.64,55.02 20.73,55.93 T2.B
N$7
  Top 0.152: R5.2 29.16,58.06 29.21,58.11 29.21,62.23 27.94,63.5 OK1.3
N$8
  Top 1.27: K2.NO 23.37,75.44 34.29,86.36 34.29,92.67 X11.1
N$9
  Top 0.152: R4.2 30.63,42.96 LED1.C
N$10
  Top 1.27: X11.2 29.25,84.62 K2.C
N$11
  Top 0.152: R14.1 45.72,56.39 42.67,56.39 42.06,57 38.1,57 37.19,56.08 T3.B
N$12
  Top 0.152: OK3.3 44.45,63.5 45.72,62.23 R14.2
N$13
  Top 0.152: 50.75,92.66 X12.1
  Top 1.27: K3.NO 39.88,74.22 50.8,85.14 50.8,92.71 50.75,92.66
N$14
  Top 1.27: X12.2 45.72,92.67 K3.C
N$15
  Top 0.152: R17.1 62.18,56.39 59.59,56.39 58.98,57 54.71,57 53.8,56.08 T4.B
N$16
  Top 0.152: R17.2 62.18,58.06 62.23,58.12 62.23,62.23 60.96,63.5 OK4.3
N$17
  Top 0.152: 67.21,85.09 67.21,86.36 67.21,92.66 X13.1
  Top 1.27: K4.NO 56.39,74.27 67.21,85.09 67.27,85.15 X13.1
N$18
  Top 0.152: 62.33,92.66 X13.2
  Top 1.27: K4.C 62.23,93.98 62.33,93.88 62.33,92.66
N$19  (via drill 0.35)
  Top 0.152: v74.98,56.24 78.64,56.24 R19.1 | v69.95,54.86 68.89,55.93 T5.B
  Bottom 0.152: v74.98,56.24 71.32,56.24 v69.95,54.86
N$20
  Top 0.152: R10.1 13.87,56.39 12.19,56.39 11.58,57 6.4,57 5.49,56.08 T1.B
N$21
  Top 0.152: R19.2 78.64,58.06 78.64,62.33 77.47,63.5 OK5.3
N$22
  Top 0.152: R10.2 13.92,58.06 13.97,58.11 13.97,62.23 12.7,63.5 OK2.3
N$23
  Top 1.27: K5.NO 72.9,74.17 83.78,85.05 X14.1
N$24
  Top 1.27: X14.2 78.78,84.62 K5.C
N$25  (via drill 0.35)
  Top 0.152: v94.03,56.24 95.25,56.24 R21.1 | v88.39,55.32 88.09,55.02 86.41,55.02 85.5,55.93 T6.B
  Bottom 0.152: v94.03,56.24 89.31,56.24 v88.39,55.32
N$26  (via drill 0.35)
  Top 0.152: R31.1 103.33,48.16 103.33,47.55 105.16,45.72 R30.2 106.68,47.36 106.68,49.53 107.9,50.75 125.6,50.75 125.98,50.37 v125.98,45.72 | 127.1,33.68 127.1,32.61 U5.RXD0 126.99,41.92 v125.98,43.18
  Bottom 0.152: v125.98,45.72 v125.98,43.18
N$27
  Top 0.152: OK6.3 93.98,63.5 95.25,62.23 R21.2
N$28
  Top 1.27: K6.NO 89.41,74.22 100.29,85.1 X15.1
N$29
  Top 0.152: 95.25,85.09 K6.C
  Top 1.27: X15.2 95.29,85.13 95.25,85.09
N$30
  Top 0.152: R23.1 111.71,56.39 108.66,56.39 108.05,57 104.24,57 103.33,56.08 T7.B
N$31
  Top 0.152: R23.2 111.71,58.06 111.71,58.37 111.76,58.42 111.76,62.23 110.49,63.5 OK7.3
N$32
  Top 1.27: K7.NO 105.92,74.27 116.8,85.15 X16.1
N$33
  Top 1.27: X16.2 111.8,84.62 K7.C
N$34
  Top 0.152: R27.1 129.54,56.39 126.49,56.39 125.88,57 121.92,57 121.01,56.08 T8.B
N$35
  Top 0.152: OK8.3 128.27,63.5 129.54,62.23 R27.2
N$36
  Top 0.152: 103.33,35.66 R25.1 104.14,36.46 104.14,44.45 104.37,44.68 106.91,44.68 107.16,44.93 107.16,46.51 107.63,46.99 124.46,46.99 124.97,47.5 124.97,48.92 U5.CH_PD
N$37
  Top 0.152: R28.1 103.17,40.54 103.17,39.47 102.56,38.86 102.56,34.9 103.17,34.29 115.67,34.29 116.13,33.83 116.13,30.98 116.63,30.48 120.99,30.48 | 120.52,31.42 120.85,31.75 120.85,32.46 U5.GPIO0 120.99,30.48 | U$5.2 123.19,23.14 120.99,25.34 120.99,30.48
  Bottom 0.508: U$5.2 U$5.1 | U$5.1 134.34,23.14 134.62,22.86 134.34,22.86 U$5.1
N$38
  Top 0.152: U5.GPIO15 116.89,32.61 116.89,35.51 116.13,36.27 108.51,36.27 106.68,38.1 106.68,41.91 105.41,43.18 R29.2
N$39
  Top 1.27: K8.NO 122.43,74.32 133.35,85.24 133.35,92.71 X17.1
N$40
  Top 0.152: 128.32,85.09 128.32,84.58 K8.C
  Top 1.27: X17.2 128.31,85.1 128.32,85.09
N$41  (via drill 2.54)
  other vias: 11.43,39.37
N$42  (via drill 2.54)
  other vias: 15.24,39.37
N$43  (via drill 2.54)
  other vias: 19.05,39.37
N$44  (via drill 2.54)
  other vias: 11.43,35.56
N$45  (via drill 2.54)
  other vias: 15.24,35.56
N$46  (via drill 2.54)
  other vias: 19.05,35.56
N$47  (via drill 2.54)
  other vias: 11.43,31.75
N$48  (via drill 2.54)
  other vias: 15.24,31.75
N$49  (via drill 2.54)
  other vias: 19.05,31.75
N$50  (via drill 2.54)
  other vias: 11.43,27.94
N$51  (via drill 2.54)
  other vias: 15.24,27.94
N$52  (via drill 2.54)
  other vias: 19.05,27.94
N$53  (via drill 2.54)
  other vias: 11.43,43.18
N$54  (via drill 2.54)
  other vias: 15.24,43.18
N$55  (via drill 2.54)
  other vias: 19.05,43.18
N$56  (via drill 1.02)
  other vias: 118.11,43.18
N$57  (via drill 1.02)
  other vias: 120.65,43.18
N$58  (via drill 1.02)
  other vias: 118.11,40.64
N$59  (via drill 1.02)
  other vias: 118.11,38.1
N$60  (via drill 1.02)
  other vias: 118.11,35.56
N$61  (via drill 1.02)
  other vias: 120.65,35.56
N$62  (via drill 1.02)
  other vias: 120.65,38.1
N$63  (via drill 1.02)
  other vias: 120.65,40.64
N$64  (via drill 1.02)
  other vias: 115.57,43.18
N$65  (via drill 1.02)
  other vias: 115.57,40.64
N$66  (via drill 1.02)
  other vias: 115.57,38.1
N$67  (via drill 1)
  other vias: 115.57,45.72
N$68  (via drill 1)
  other vias: 118.11,45.72
N$69  (via drill 1)
  other vias: 120.65,45.72
N$70  (via drill 0.2)
  other vias: 55.88,41.91
N$71  (via drill 0.2)
  other vias: 55.88,40.64
N$72  (via drill 0.2)
  other vias: 55.88,38.1
N$73  (via drill 0.35)
  other vias: 33.02,31.75
N$74  (via drill 0.2)
  other vias: 57.15,38.1
N$75  (via drill 0.2)
  other vias: 58.42,38.1
N$76  (via drill 0.35)
  other vias: 33.02,33.02
N$77  (via drill 0.35)
  other vias: 33.02,35.56
N$78  (via drill 0.35)
  other vias: 33.02,36.83
N$79  (via drill 0.2)
  other vias: 57.15,40.64
N$80  (via drill 0.2)
  other vias: 69.85,38.1
N$81  (via drill 0.2)
  other vias: 71.12,38.1
N$82  (via drill 0.2)
  other vias: 72.39,38.1
N$83  (via drill 0.2)
  other vias: 58.42,40.64
N$84  (via drill 0.2)
  other vias: 119.38,44.45
N$85  (via drill 0.2)
  other vias: 116.84,44.45
N$86  (via drill 0.2)
  other vias: 116.84,41.91
N$87  (via drill 0.2)
  other vias: 119.38,41.91
N$88  (via drill 0.2)
  other vias: 116.84,39.37
N$89  (via drill 0.2)
  other vias: 119.38,39.37
N$90  (via drill 0.2)
  other vias: 116.84,36.83
N$91  (via drill 0.2)
  other vias: 119.38,36.83
N$92  (via drill 0.2)
  other vias: 121.92,36.83
N$93  (via drill 0.2)
  other vias: 121.92,39.37
N$94  (via drill 0.2)
  other vias: 21.59,25.4
N$95  (via drill 0.2)
  other vias: 21.59,27.94
N$96  (via drill 0.2)
  other vias: 21.59,26.67
N$97  (via drill 0.2)
  other vias: 21.59,29.21
N$98  (via drill 0.2)
  other vias: 21.59,30.48
N$99  (via drill 0.2)
  other vias: 21.59,31.75
N$100  (via drill 0.2)
  other vias: 21.59,33.02
N$101  (via drill 0.2)
  other vias: 21.59,34.29
N$102  (via drill 0.2)
  other vias: 21.59,35.56
N$103  (via drill 0.2)
  other vias: 21.59,36.83
N$104  (via drill 0.2)
  other vias: 21.59,38.1
N$105  (via drill 0.2)
  other vias: 21.59,40.64
N$106  (via drill 0.2)
  other vias: 21.59,39.37
N$107  (via drill 0.2)
  other vias: 21.59,41.91
N$108  (via drill 0.2)
  other vias: 21.59,44.45
N$109  (via drill 0.2)
  other vias: 21.59,43.18
N$110  (via drill 0.2)
  other vias: 21.59,45.72
N$111  (via drill 0.2)
  other vias: 19.05,45.72
N$112  (via drill 0.2)
  other vias: 20.32,45.72
N$113  (via drill 0.2)
  other vias: 17.78,45.72
N$114  (via drill 0.2)
  other vias: 16.51,45.72
N$115  (via drill 0.2)
  other vias: 13.97,45.72
N$116  (via drill 0.2)
  other vias: 12.7,45.72
N$117  (via drill 0.2)
  other vias: 15.24,45.72
N$118  (via drill 0.2)
  other vias: 11.43,45.72
N$119  (via drill 0.2)
  other vias: 10.16,45.72
N$120  (via drill 0.2)
  other vias: 8.89,45.72
N$121  (via drill 0.2)
  other vias: 8.89,43.18
N$122  (via drill 0.2)
  other vias: 8.89,44.45
N$123  (via drill 0.2)
  other vias: 8.89,41.91
N$124  (via drill 0.2)
  other vias: 8.89,40.64
N$125  (via drill 0.2)
  other vias: 8.89,38.1
N$126  (via drill 0.2)
  other vias: 8.89,39.37
N$127  (via drill 0.2)
  other vias: 8.89,36.83
N$128  (via drill 0.2)
  other vias: 8.89,34.29
N$129  (via drill 0.2)
  other vias: 8.89,35.56
N$130  (via drill 0.2)
  other vias: 8.89,33.02
N$131  (via drill 0.2)
  other vias: 8.89,31.75
N$132  (via drill 0.2)
  other vias: 8.89,30.48
N$133  (via drill 0.2)
  other vias: 8.89,29.21
N$134  (via drill 0.2)
  other vias: 8.89,26.67
N$135  (via drill 0.2)
  other vias: 8.89,27.94
N$136  (via drill 0.2)
  other vias: 10.16,25.4
N$137  (via drill 0.2)
  other vias: 8.89,25.4
N$138  (via drill 0.2)
  other vias: 11.43,25.4
N$139  (via drill 0.2)
  other vias: 12.7,25.4
N$140  (via drill 0.2)
  other vias: 15.24,25.4
N$141  (via drill 0.2)
  other vias: 13.97,25.4
N$142  (via drill 0.2)
  other vias: 16.51,25.4
N$143  (via drill 0.2)
  other vias: 17.78,25.4
N$144  (via drill 0.2)
  other vias: 20.32,25.4
N$145  (via drill 0.2)
  other vias: 19.05,25.4
N$146  (via drill 0.2)
  other vias: 121.92,41.91
N$147  (via drill 0.2)
  other vias: 121.92,44.45
N$148  (via drill 0.2)
  other vias: 129.54,43.18
N$149  (via drill 0.2)
  other vias: 129.54,40.64
N$150  (via drill 0.2)
  other vias: 129.54,41.91
N$151  (via drill 0.2)
  other vias: 129.54,39.37
N$152  (via drill 0.2)
  other vias: 129.54,38.1
N$153  (via drill 0.2)
  other vias: 129.54,36.83
N$154  (via drill 0.2)
  other vias: 129.54,35.56
N$155  (via drill 0.2)
  other vias: 125.73,40.64
N$156  (via drill 0.2)
  other vias: 125.73,39.37
N$157  (via drill 0.2)
  other vias: 125.73,38.1
N$158  (via drill 0.2)
  other vias: 125.73,36.83
N$159  (via drill 0.2)
  other vias: 125.73,35.56
O1  (via drill 0.35)
  Top 0.152: v19.51,56.39 17.83,56.39 R11.2 | v72.08,49.78 72.39,49.48 IC3.1
  Bottom 0.152: v19.51,56.39 34.9,56.39 35.36,56.84 65.02,56.84 v72.08,49.78
O2  (via drill 0.35)
  Top 0.152: v35.66,56.24 33.07,56.24 R6.2 | v71.17,49.78 71.17,45.57 IC3.2
  Bottom 0.152: v35.66,56.24 64.72,56.24 v71.17,49.78
O3
  Top 0.152: R15.2 49.53,56.39 52.43,56.39 53.34,57.3 71.17,57.3 71.63,56.84 71.63,54.97 69.95,53.29 69.95,45.57 IC3.3
O4
  Top 0.152: IC3.4 68.58,53.72 68.57,53.72 R18.2
O5  (via drill 0.35)
  Top 0.152: v88.39,57 95.86,57 96.47,56.39 99.06,56.39 R22.2 | v68.58,43.89 67.36,45.11 67.36,45.41 IC3.5
  Bottom 0.152: v68.58,43.89 85.8,43.89 87.12,45.21 87.12,55.73 v88.39,57
O6  (via drill 0.35)
  Top 0.152: R20.2 84.48,54.32 84.48,44.7 83.67,43.89 73.56,43.89 73,44.45 v73,46.79 | v66.7,46.79 66.04,46.13 IC3.6
  Bottom 0.152: 73.05,46.79 v73,46.79 v66.7,46.79
O7
  Top 0.152: IC3.7 64.77,46.28 64.41,46.63 63.09,46.63 62.94,46.48 62.94,43.74 63.7,42.98 84.05,42.98 85.39,44.32 85.39,52.2 86.24,53.04 115.06,53.04 115.57,53.54 R24.2
O8  (via drill 0.35)
  Top 0.152: v133.3,53.65 133.35,53.65 R32.2 | IC3.8 63.55,45.41 63.55,43.56 63.83,43.28 83.92,43.28 85.09,44.45 85.09,52.58 86.16,53.65 v114.76,53.65
  Bottom 0.152: v114.76,53.65 v133.3,53.65
RST  (via drill 0.35)
  Top 0.152: R13.1 103.33,32.92 v103.33,31.85 104.7,30.48 v111.76,30.48 | v103.33,36.73 103.33,38.1 R26.1 | v89.97,39.93 89.27,40.63 C13.1 | v59.94,37.74 59.94,36.47 59.74,36.27 59.74,35.97 IC3.18 | U5.RESET 128.93,48.92 128.93,45.11 128.27,44.45 124.46,44.45 123.19,43.18 123.19,35.56 122.07,34.44 122.07,25.86 123.5,24.43 129.24,24.43 129.54,24.13 129.54,17.78 129.26,17.5 U$6.4 127.28,17.78 v120.65,17.78
  Bottom 0.152: v103.33,31.85 v103.33,36.73 103.33,38.91 102.31,39.93 v89.97,39.93 62.13,39.93 v59.94,37.74 | v111.76,30.48 114.3,30.48 120.65,24.13 v120.65,17.78
  Bottom 0.508: U$6.4 U$6.3
RX  (via drill 0.35)
  Top 0.152: 126.95,6.4 J8.4 v118.11,6.35 | v111.76,27.94 111.73,27.91 102.84,27.91 101.96,28.8 101.96,45.36 102.31,45.72 R30.1
  Top 0.508: v118.11,6.35 118.16,6.4 126.95,6.4
  Bottom 0.152: v118.11,6.35 118.11,23.52 113.69,27.94 v111.76,27.94
S1
  Top 0.152: 32.16,24.08 R12.1 | 34.9,20.12 U$1.2 | IC3.21 63.4,35.81 63.4,31.75 63.4,31.65 62.23,30.48 36.83,30.48 35,28.65 U$1.2 | U$1.2 35.05,20.12 34.98,20.04 | 29.41,20.12 28.5,20.12 U$1.1 | 34.14,6.4 X5.2 | 34.9,19.96 U$1.2
  Top 0.508: X5.2 33.02,6.35 31.75,7.62 31.75,20.04 | U$1.1 31.75,20.04 | 31.75,20.04 U$1.2 | R12.1 31.75,23.76 31.75,20.04
S2
  Top 0.152: 43.59,24.08 R16.1 | 45.57,6.4 X6.2 | IC3.22 64.77,31.34 62.23,28.8 47.85,28.8 46.99,27.94 46.99,20.6 U$2.2
  Top 0.508: X6.2 44.45,6.35 43.18,7.62 43.18,20.04 | U$2.1 43.18,20.04 | 43.18,20.04 U$2.2 | 43.18,20.04 43.18,24.13 R16.1
S3
  Top 0.152: 55.02,24.08 R2.1 | 65.99,35.81 IC3.23 66.04,30.48 62.23,26.67 59.69,26.67 58.42,25.4 58.42,20.6 | 57,6.4 X7.2
  Top 0.508: X7.2 55.88,6.35 54.61,7.62 54.61,20.04 | U$4.1 54.61,20.04 | 54.61,20.04 U$4.2 58.42,20.6 | 54.61,20.04 54.61,23.76 R2.1
S4
  Top 0.152: 66.34,24.08 R3.1 66.41,24.5 67.31,25.4 IC3.24 | 68.43,6.4 X8.2
  Top 0.508: X8.2 67.31,6.35 66.04,7.62 66.04,20.32 | 66.04,20.32 66.04,23.76 R3.1 | U$7.1 U$7.2 66.32,20.04 66.04,20.32
S5
  Top 0.152: 77.78,24.08 R1.1 76.57,25.4 72.39,25.4 68.58,29.21 IC3.25 | 79.86,6.4 X3.2
  Top 0.508: 77.47,20.12 80.64,20.12 U$3.2 | 77.47,20.12 74.3,20.12 U$3.1 | 77.47,20.12 77.47,23.77 77.78,24.08 | X3.2 78.74,6.35 77.47,7.62 77.47,20.12
S6  (1 unrouted)
  Top 0.152: IC3.26 69.95,35.81 69.95,29.21 71.42,27.74 73.15,26.01 79.08,26.01 85.05,20.04 U$8.1 | 91.29,6.4 X1.2 | 91.36,20.04 91.44,20.12
  Top 0.508: U$8.1 88.9,20.04 | 88.9,20.04 U$8.2 | 88.9,20.04 88.9,23.76 R7.1 | X1.2 90.17,6.35 88.9,7.62 88.9,20.04
S7
  Top 0.152: 100.64,24.08 R8.1 96.52,24.13 95.68,24.97 95.68,28.37 94.84,29.21 72.39,29.21 71.17,30.43 71.17,35.81 IC3.27 | 97.08,20.12 U$9.1 | 102.72,6.4 X2.2
  Top 0.508: U$9.1 100.33,20.04 | X2.2 101.6,6.35 100.33,7.62 100.33,20.04 | 100.33,20.04 U$9.2 | 100.33,20.04 100.33,23.77 100.64,24.08
S8
  Top 0.152: 108.51,20.12 U$10.1 | 111.94,23.95 111.94,25.21 110.31,26.85 101.78,26.85 99.06,29.57 73.3,29.57 72.39,30.48 IC3.28
  Top 0.508: U$10.1 111.76,20.04 | 111.76,20.04 U$10.2 | X4.2 111.76,8.85 111.76,20.04 | 111.76,20.04 111.76,23.76 111.94,23.95 R9.1
  Bottom 0.152: 108.51,20.12 U$10.1
SCL  (via drill 0.35)
  Top 0.152: 58.52,44.96 58.52,45.41 IC3.12 58.42,43.18 58.93,42.67 84.17,42.67 85.7,44.2 85.7,52.07 86.36,52.73 125.73,52.73 127.82,50.65 127.82,47.34 127,46.53 v127,45.72 | U5.GPIO5 123.19,32.34 123.19,30.48 127.41,30.48 127.86,30.94 127.86,42.32 v127,43.18
  Bottom 0.152: v127,45.72 v127,43.18
SDA  (via drill 0.35)
  Top 0.152: IC3.13 57.15,43.84 v57.71,43.28 | v124.71,42.22 124.71,32.82 U5.GPIO4
  Bottom 0.152: v57.71,43.28 60.25,40.74 104.14,40.74 105.41,42.01 105.41,49.53 106.68,50.8 123.44,50.8 124.71,49.53 v124.71,42.22
TOP
  pour Top: 1.27,99.06 1.27,1.27 144.78,1.27 144.78,99.06
TX
  Top 0.508: U5.TXD0 130.78,30.75 130.78,7.64 129.54,6.4 J8.3
VCC  (via drill 0.35)
  Top 0.152: 18.44,82.6 K1.1 | 34.75,82.6 K2.1 | D8.C 125.73,55.93 128.47,55.93 128.93,55.47 130.15,55.47 130.45,55.78 130.45,56.69 129.84,57.3 128.96,57.3 128.71,57.55 128.71,57.98 128.27,58.42 128.27,59.69 127,60.96 OK8.4 | 110.49,57.3 102.87,57.3 101.04,55.47 93.88,55.47 93.42,55.93 91.44,55.93 D6.C | 110.49,57.3 112.17,57.3 112.62,56.84 112.62,55.78 112.32,55.47 111.1,55.47 110.64,55.93 108.05,55.93 D7.C | D5.C 73.76,57.15 73.76,60.96 OK5.4 | v95.1,51.36 95.1,48.31 C3.1 | U4.3 36.12,36.73 35.66,37.19 35.66,40.84 LED1.A 35.66,41 35.66,41.45 36.42,42.22 36.42,44.8 35.5,45.72 33.43,45.72 | 26.67,55.88 D2.C | 33.43,45.72 33.43,54.2 32.01,55.62 28.52,55.62 28.26,55.88 26.67,55.88 | 29.72,46.94 C1.1 30.85,45.72 33.43,45.72 | 46.63,55.78 46.33,55.47 45.11,55.47 44.65,55.93 41.91,55.93 D3.C | 46.63,55.78 46.63,56.69 46.02,57.3 44.35,57.3 40.69,60.96 OK3.4 | 46.63,55.78 47.7,54.71 55.78,54.71 57,55.93 58.37,55.93 D4.C | HLK1.P$3 7.62,49.07 10.06,51.51 10.06,55.93 D1.C 10.28,55.88 11.81,55.88 12.57,55.12 21.03,55.12 21.59,54.56 23.14,54.56 24.46,55.88 26.67,55.88 | OK7.4 109.22,60.96 110.49,59.69 110.49,57.3
  Bottom 0.152: 101.04,82.45 K6.1 100.89,82.6 | 117.35,82.45 K7.1 117.5,82.6 | 133.81,82.6 K8.1 | 51.51,82.45 K3.1 51.36,82.45 51.13,82.22 | 67.82,82.45 K4.1 67.97,82.6 | 84.28,82.6 K5.1 84.43,82.6 | 34.9,82.45 K2.1 | v95.1,51.36 95.1,58.22 95.25,58.37 | 90.07,60.96 OK6.4 | 40.69,60.96 OK3.4 | 7.57,49.12 7.62,49.07 HLK1.P$3 | 93.98,58.37 95.25,58.37 | 95.25,58.37 97.84,58.37
  Bottom 1.27: K1.1 18.36,78.16 19.05,77.47 33.02,77.47 34.9,79.35 | 34.9,82.45 34.9,79.35 | 34.9,79.35 36.78,77.47 49.53,77.47 51.13,79.07 51.13,82.22 | K3.1 51.38,79.43 53.34,77.47 66.04,77.47 67.97,79.4 | 67.97,79.4 67.97,82.6 | 67.97,79.4 69.85,77.52 69.85,77.47 82.55,77.47 84.4,79.32 | K5.1 84.4,79.32 | 84.4,79.32 84.51,79.32 86.36,77.47 99.06,77.47 100.89,79.3 100.89,79.45 | 100.89,79.45 100.89,82.6 | 100.89,79.45 102.87,77.47 115.57,77.47 117.42,79.32 117.42,80.01 | 117.42,80.01 K7.1 | 117.42,80.01 119.96,77.47 133.35,77.47 133.93,78.05 | 133.93,78.05 K8.1 | HLK1.P$3 7.54,57.15 8.81,58.42 | 8.81,58.42 22.86,58.42 | 22.86,58.42 22.86,60.96 OK1.4 | 22.86,58.42 39.37,58.42 | 39.37,58.42 40.64,59.69 OK3.4 | 39.37,58.42 55.88,58.42 | 55.88,58.42 57.15,59.69 OK4.4 | 90.07,60.96 87.53,58.42 76.2,58.42 OK5.4 69.85,60.96 67.31,58.42 55.88,58.42 | OK6.4 91.39,60.96 93.98,58.37 105.36,58.37 | OK7.4 106.68,59.69 105.36,58.37 | 123.19,58.42 113.64,58.42 113.59,58.37 105.36,58.37 | 123.19,58.42 124.46,59.69 OK8.4 | 123.19,58.42 132.13,58.42 137.37,53.18 | J8.1 137.37,9.1 137.37,53.18 | 137.37,53.18 137.37,74.61 133.93,78.05 | 8.81,58.42 8.89,58.5 OK2.4